# EAGLE design Thermometer (EAGLE 6.4)
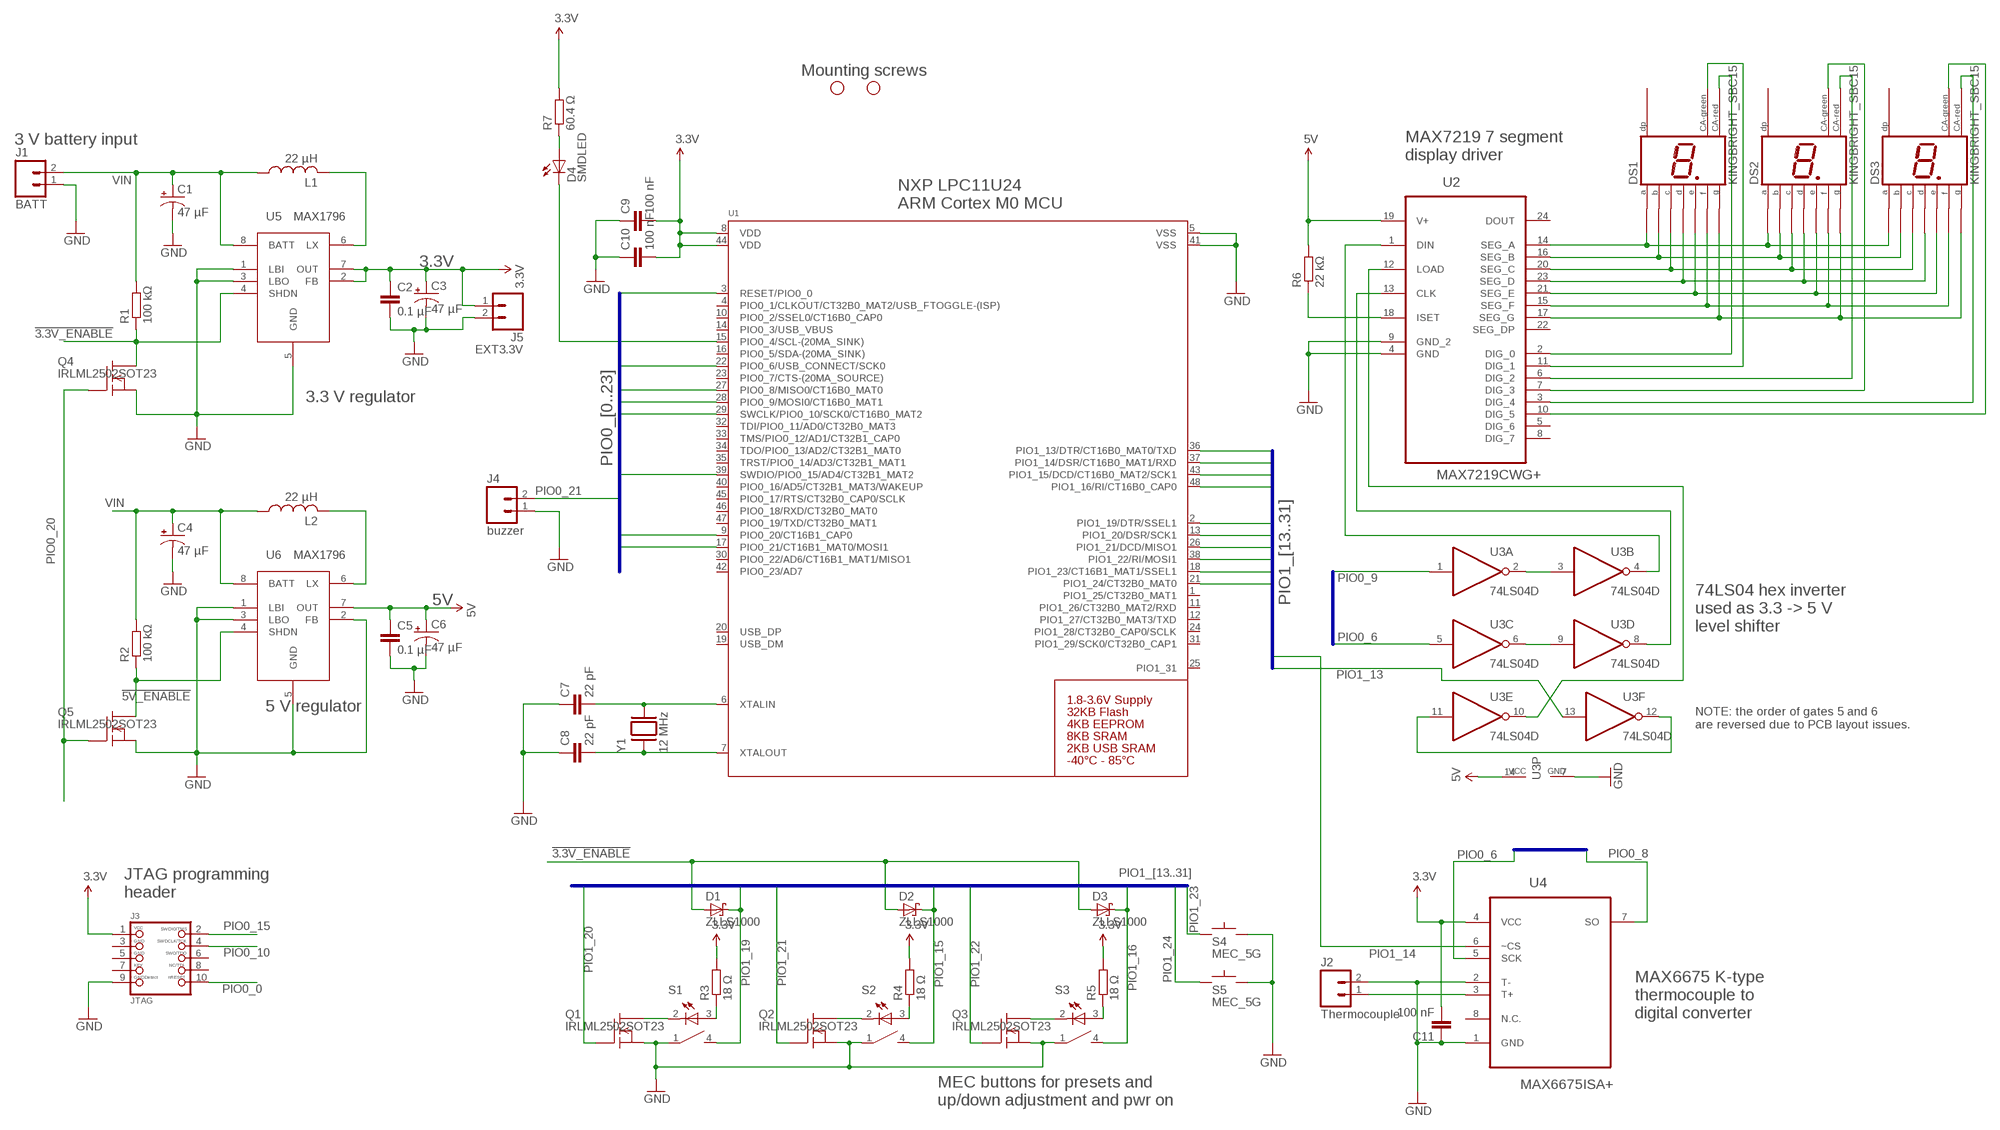
[diagram p0: schematic, sheet 1]

## Parts
C1  47 µF  CPOL-USSMCB  [SMC_B]
C2  0.1 µF  C-EUC0805K  [C0805K]
C3  47 µF  CPOL-USSMCB  [SMC_B]
C4  47 µF  CPOL-USSMCB  [SMC_B]
C5  0.1 µF  C-EUC0805K  [C0805K]
C6  47 µF  CPOL-USSMCB  [SMC_B]
C7  22 pF  C-EUC0805K  [C0805K]
C8  22 pF  C-EUC0805K  [C0805K]
C9  100 nF  C-EUC0805K  [C0805K]
C10  100 nF  C-EUC0805K  [C0805K]
C11  100 nF  C-EUC0805K  [C0805K]
D1  ZLLS1000  BAS40  [SOT23]
D2  ZLLS1000  BAS40  [SOT23]
D3  ZLLS1000  BAS40  [SOT23]
D4  SMDLED  [1206]
DS1  KINGBRIGHT_SBC15  [7-SEG_SBC15]
DS2  KINGBRIGHT_SBC15  [7-SEG_SBC15]
DS3  KINGBRIGHT_SBC15  [7-SEG_SBC15]
J1  BATT  M02PTH  [1X02]
J2  Thermocouple  M02PTH3  [1X02_LONGPADS]
J3  JTAG  JTAG-CORTEXM3  [2X05_1.27MM_SMT]
J4  buzzer  M02PTH  [1X02]
J5  EXT3.3V  M02PTH  [1X02]
L1  22 µH  PANASONIC_ELL5PS  [ELL5PS_INDUCTOR]
L2  22 µH  PANASONIC_ELL5PS  [ELL5PS_INDUCTOR]
MP1  STAND-OFF  [STAND-OFF]
MP2  STAND-OFF  [STAND-OFF]
Q1  IRLML2502SOT23  [SOT23-3]
Q2  IRLML2502SOT23  [SOT23-3]
Q3  IRLML2502SOT23  [SOT23-3]
Q4  IRLML2502SOT23  [SOT23-3]
Q5  IRLML2502SOT23  [SOT23-3]
R1  100 kΩ  R-EU_M0805  [M0805]
R2  100 kΩ  R-EU_M0805  [M0805]
R3  18 Ω  R-EU_M0805  [M0805]
R4  18 Ω  R-EU_M0805  [M0805]
R5  18 Ω  R-EU_M0805  [M0805]
R6  22 kΩ  R-EU_M0805  [M0805]
R7  60.4 Ω  R-EU_M0805  [M0805]
S1  ILLUMEC-4FTH9  [ILLUMEC-4F-TH9]
S2  ILLUMEC-4FTH9  [ILLUMEC-4F-TH9]
S3  ILLUMEC-4FTH9  [ILLUMEC-4F-TH9]
S4  MEC_5G  [ILLUMEC-4F-TH9]
S5  MEC_5G  [ILLUMEC-4F-TH9]
U1  LPC11U24_QFP48  [LQFP48]
U2  MAX7219CWG+  [SOIC127P1032X265-24N]
U3  74LS04D  [SO14]
U4  MAX6675ISA+  [SOIC127P600X175-8N]
U5  MAX1796  [UMAX8]
U6  MAX1796  [UMAX8]
Y1  12 MHz  SMDCRYSTAL  [XTAL_ABM7]

## Nets
3.3V: C2.1 C3.+ C9.2 C10.2 C11.2 J3.1 J5.1 R3.2 R4.2 R5.2 R7.2 U1.8(VDD) U1.44(VDD) U4.4(VCC) U5.2(FB) U5.7(OUT)
5V: C5.1 C6.+ R6.2 U2.19(V+) U3.14(P:VCC) U6.7(OUT)
!3.3V_ENABLE: D1.1(A) D2.1(A) D3.1(A) Q4.3(D) R1.1 U5.4(SHDN)
!5V_ENABLE: Q5.3(D) R2.1 U6.4(SHDN)
GND: C1.- C2.2 C3.- C4.- C5.2 C6.- C7.1 C8.1 C9.1 C10.1 C11.1 J1.1 J2.2 J3.9 J4.1 J5.2 Q1.2(S) Q2.2(S) Q3.2(S) Q4.2(S) Q5.2(S) S1.1 S2.1 S3.1 S4.3 S4.4 S5.3 S5.4 U1.5(VSS) U1.41(VSS) U2.4(GND) U2.9(GND_2) U3.7(P:GND) U4.1(GND) U4.2(T-) U5.1(LBI) U5.3(LBO) U5.5(GND) U6.1(LBI) U6.2(FB) U6.3(LBO) U6.5(GND)
N$1: DS1.P$7(A) DS2.P$7(A) DS3.P$7(A) U2.14(SEG_A)
N$2: DS1.P$6(B) DS2.P$6(B) DS3.P$6(B) U2.16(SEG_B)
N$3: DS1.P$4(C) DS2.P$4(C) DS3.P$4(C) U2.20(SEG_C)
N$4: DS1.P$3(D) DS2.P$3(D) DS3.P$3(D) U2.23(SEG_D)
N$5: DS1.P$2(E) DS2.P$2(E) DS3.P$2(E) U2.21(SEG_E)
N$6: DS1.P$9(F) DS2.P$9(F) DS3.P$9(F) U2.15(SEG_F)
N$7: DS1.P$10(G) DS2.P$10(G) DS3.P$10(G) U2.17(SEG_G)
N$8: DS2.P$5(CA-G) U2.7(DIG_3)
N$9: DS2.P$1(CA-R) U2.6(DIG_2)
N$10: DS3.P$1(CA-R) U2.3(DIG_4)
N$11: DS1.P$5(CA-G) U2.11(DIG_1)
N$12: DS1.P$1(CA-R) U2.2(DIG_0)
N$13: DS3.P$5(CA-G) U2.10(DIG_5)
N$14: R5.1 S3.3(A)
N$15: U3.2(A:O) U3.3(B:I)
N$16: U2.1(DIN) U3.4(B:O)
N$17: U2.13(CLK) U3.8(D:O)
N$18: U2.12(LOAD) U3.10(E:O)
N$19: R6.1 U2.18(ISET)
N$20: Q3.3(D) S3.2(C)
N$21: R4.1 S2.3(A)
N$22: R3.1 S1.3(A)
N$23: Q2.3(D) S2.2(C)
N$24: Q1.3(D) S1.2(C)
N$25: J2.1 U4.3(T+)
N$26: C7.2 U1.6(XTALIN) Y1.P$2
N$27: C8.2 U1.7(XTALOUT) Y1.P$1
N$28: D4.1(A) R7.1
N$29: L2.P$2 U6.6(LX)
N$30: U3.6(C:O) U3.9(D:I)
N$31: L1.P$2 U5.6(LX)
N$32: U3.11(E:I) U3.12(F:O)
PIO0_0: J3.10 U1.3(RESET/PIO0_0)
PIO0_4: D4.2(C) U1.15(PIO0_4/SCL-(20MA_SINK))
PIO0_6: U1.22(PIO0_6/USB_CONNECT/SCK0) U3.5(C:I) U4.5(SCK)
PIO0_8: U1.27(PIO0_8/MISO0/CT16B0_MAT0) U4.7(SO)
PIO0_9: U1.28(PIO0_9/MOSI0/CT16B0_MAT1) U3.1(A:I)
PIO0_10: J3.4 U1.29(SWCLK/PIO0_10/SCK0/CT16B0_MAT2)
PIO0_15: J3.2 U1.39(SWDIO/PIO0_15/AD4/CT32B1_MAT2)
PIO0_20: Q4.1(G) Q5.1(G) U1.9(PIO0_20/CT16B1_CAP0)
PIO0_21: J4.2 U1.17(PIO0_21/CT16B1_MAT0/MOSI1)
PIO1_13: U1.36(PIO1_13/DTR/CT16B0_MAT0/TXD) U3.13(F:I)
PIO1_14: U1.37(PIO1_14/DSR/CT16B0_MAT1/RXD) U4.6(~CS)
PIO1_15: D2.3(C) S2.4 U1.43(PIO1_15/DCD/CT16B0_MAT2/SCK1)
PIO1_16: D3.3(C) S3.4 U1.48(PIO1_16/RI/CT16B0_CAP0)
PIO1_19: D1.3(C) S1.4 U1.2(PIO1_19/DTR/SSEL1)
PIO1_20: Q1.1(G) U1.13(PIO1_20/DSR/SCK1)
PIO1_21: Q2.1(G) U1.26(PIO1_21/DCD/MISO1)
PIO1_22: Q3.1(G) U1.38(PIO1_22/RI/MOSI1)
PIO1_23: S4.1 S4.2 U1.18(PIO1_23/CT16B1_MAT1/SSEL1)
PIO1_24: S5.1 S5.2 U1.21(PIO1_24/CT32B0_MAT0)
VIN: C1.+ C4.+ J1.2 L1.P$1 L2.P$1 R1.2 R2.2 U5.8(BATT) U6.8(BATT)
Unconnected: DS1.P$8(DP) DS2.P$8(DP) DS3.P$8(DP) J3.3 J3.5 J3.6 J3.7 J3.8 U1.1(PIO1_25/CT32B0_MAT1) U1.4(PIO0_1/CLKOUT/CT32B0_MAT2/USB_FTOGGLE-(ISP)) U1.10(PIO0_2/SSEL0/CT16B0_CAP0) U1.11(PIO1_26/CT32B0_MAT2/RXD) U1.12(PIO1_27/CT32B0_MAT3/TXD) U1.14(PIO0_3/USB_VBUS) U1.16(PIO0_5/SDA-(20MA_SINK)) U1.19(USB_DM) U1.20(USB_DP) U1.23(PIO0_7/CTS-(20MA_SOURCE)) U1.24(PIO1_28/CT32B0_CAP0/SCLK) U1.25(PIO1_31) U1.30(PIO0_22/AD6/CT16B1_MAT1/MISO1) U1.31(PIO1_29/SCK0/CT32B0_CAP1) U1.32(TDI/PIO0_11/AD0/CT32B0_MAT3) U1.33(TMS/PIO0_12/AD1/CT32B1_CAP0) U1.34(TDO/PIO0_13/AD2/CT32B1_MAT0) U1.35(TRST/PIO0_14/AD3/CT32B1_MAT1) U1.40(PIO0_16/AD5/CT32B1_MAT3/WAKEUP) U1.42(PIO0_23/AD7) U1.45(PIO0_17/RTS/CT32B0_CAP0/SCLK) U1.46(PIO0_18/RXD/CT32B0_MAT0) U1.47(PIO0_19/TXD/CT32B0_MAT1) U2.5(DIG_6) U2.8(DIG_7) U2.22(SEG_DP) U2.24(DOUT) U4.8(N.C.)

## Buses
PIO1_[13..31]
PIO0_[0..23]

## Notes on the sheet
- Mounting screws
- 3 V battery input
- MAX7219 7 segment
  display driver
- NXP LPC11U24
  ARM Cortex M0 MCU
- 3.3 V regulator
- 74LS04 hex inverter
  used as 3.3 -> 5 V
  level shifter
- 5 V regulator
- NOTE: the order of gates 5 and 6 
  are reversed due to PCB layout issues.
- JTAG programming
  header
- MAX6675 K-type
  thermocouple to
  digital converter
- MEC buttons for presets and
  up/down adjustment and pwr on

## Library data of the parts
C1 C3 C4 C6 = rcl:CPOL-US: POLARIZED CAPACITOR, American symbol; POS: Project box; RS: 699-3431
C2 C5 C7-C11 = rcl:C-EU: CAPACITOR, European symbol; POS: SMD box; RS: ?
D1-D3 = diode:BAS40: Silicon Schottky Diodes General-purpose diode for high-speed switching; POS: ESD; RS: 155-169
D4 = jenswilly_custom:SMDLED: SMD LED; POS: ESD; RS: ?
DS1-DS3 = jenswilly_custom:KINGBRIGHT_SBC15: Kingbright SBC15-11/SBA15-11 1.5" dual color 7 segment display.; POS: Project box; RS: 235-9130
J1 J2 J4 = SparkFun-Connectors:M02: Header 2 Standard 2-pin 0.1" header. Use with straight break away headers (SKU : PRT-00116), right angle break away headers (PRT-00553), swiss pins (PRT-00743), machine pins (PRT-00117), and female headers (PRT-00115). Molex polarized connector foot print use with SKU : PRT-08233 with associated crimp pins and housings.; POS: n/a
J3 = microbuilder:JTAG-CORTEXM3: Serial Wire (SW-DP) Connector This standard 0.05" 10-pin connector is for use with the Cortex M0/M3's native SWD (serial wire debugger) interface (SW-DP). Some boards support a 20-pin combined JTAG+SWD connector (SWJ-DP), such as the LPC1700 family, but many smaller devices only work with SWD which typically use the smaller 10-pin SW-DP connecter (the LPC1300 family, for example, only supports SWD). 2x05 1.27mm/0.05" Connector: This is the standard SMT connector defined by ARM for all Cortex devices, and should be used in most situations and for forward-compatibility since any new devices coming to market will likely use this connector. MOLEX 10 Pin 0.1" Connector: This 0.1" 10 pin connector has the same pin layout as the standard 0.05" connector, but is easier to work with if you are using standard jumper wires or custom cables to connect your SWD hardware. MOLEX 20 Pin 0.1" Connector: This 0.1" 20 pin connector is the same model used for ARM7/ARM9 JTAG debuggers, but is connected to match the pins on the Segger J-Link for ARM (which supports both JTAG and SWD debugging). See the following document from ARM for more information on Cortex M3 Debug Connectors: http://infocenter.arm.com/help/topic/com.arm.doc.faqs/attached/13634/cortex_debug_connectors.pdf And the following page for an overview with images of the different connector types: http://www.keil.com/peripherals/coresight/connectors.asp; POS: Misc. box; RS: 681-1200
J5 = SparkFun-Connectors:M02: Header 2 Standard 2-pin 0.1" header. Use with straight break away headers (SKU : PRT-00116), right angle break away headers (PRT-00553), swiss pins (PRT-00743), machine pins (PRT-00117), and female headers (PRT-00115). Molex polarized connector foot print use with SKU : PRT-08233 with associated crimp pins and housings.
L1 L2 = jenswilly_custom:PANASONIC_ELL5PS: Panasonic ELL5PS SMD inductor; POS: SMD box; RS: ?
MP1 MP2 = SparkFun-Electromechanical:STAND-OFF: #4 Stand Off This is the mechanical footprint for a #4 phillips button head screw. Use the keepout ring to avoid running the screw head into surrounding components. SKU : PRT-00447
Q1-Q5 = jenswilly_custom:IRLML2502: IRLML2502PbF HEXFET Power MOSFET N-channel MOSFET Vdss 20V Rds(on) 0.045? Vgs(th), max 1.2V Datasheet: http://www.irf.com/product-info/datasheets/data/irlml2502.pdf; POS: ESD; RS: 610-6693
R1 R2 R6 = rcl:R-EU_: RESISTOR, European symbol; BOM: EXCLUDE; POS: ?; RS: ?
R3-R5 = rcl:R-EU_: RESISTOR, European symbol; POS: Project box; RS: 679-0964
R7 = rcl:R-EU_: RESISTOR, European symbol; POS: SMD box; RS: ?
S1-S3 = jenswilly_custom:ILLUMEC-4F: Illumec 4F; FARNELL: 2280492; POS: Project box; RS: ?
S4 S5 = jenswilly_custom:MEC_5G: MEC 5G MEC 5GTH9 normally-open momentary SPST switch, non-illuminated.; FARNELL: 2280480; POS: Project box; RS: ?
U1 = microbuilder:LPC11U24_QFP48: LPC11U24 - ARM Cortex M0 50MHz MCU Supply: 1.8-3.6V Flash: 32KB EEPROM: 4KB SRAM: 8KB + 2KB USB Temp: -40°C - 85°C; POS: ESD; RS: ?
U2 = Maxim_By_element14_Batch_1:MAX7219CWG+: Serially Interfaced, 8-Digit LED Display Drivers; BOM: EXCLUDE; MPN: MAX7219CWG+; OC_FARNELL: 9726357; OC_NEWARK: 67K6644; PACKAGE: SOIC-24; POS: ?; RS: ?; SUPPLIER: Maxim
U3 = 74xx-eu:74*04: Hex INVERTER; BOM: EXCLUDE; POS: ?; RS: ?
U4 = Maxim_By_element14_Batch_1:MAX6675ISA+: Cold-Junction-Compensated K-Thermocoupleto-to-; BOM: EXCLUDE; MPN: MAX6675ISA+; OC_FARNELL: 1379740; OC_NEWARK: 68K4982; PACKAGE: SOIC-8; POS: Project box; RS: 698-7118; SUPPLIER: Maxim
U5 U6 = jenswilly_custom:MAX1796: Maxim MAX1796 Also MAX1795, MAX1797 Low Supply Current, Step-Up DC-DC Converters with True-Shutdown Datasheet <http://datasheets.maximintegrated.com/en/ds/MAX1795-MAX1797.pdf>; POS: Project box; RS: 732-7721
Y1 = jenswilly_custom:SMDCRYSTAL: SMD Crystal; POS: SMD box; RS: ?

## Board
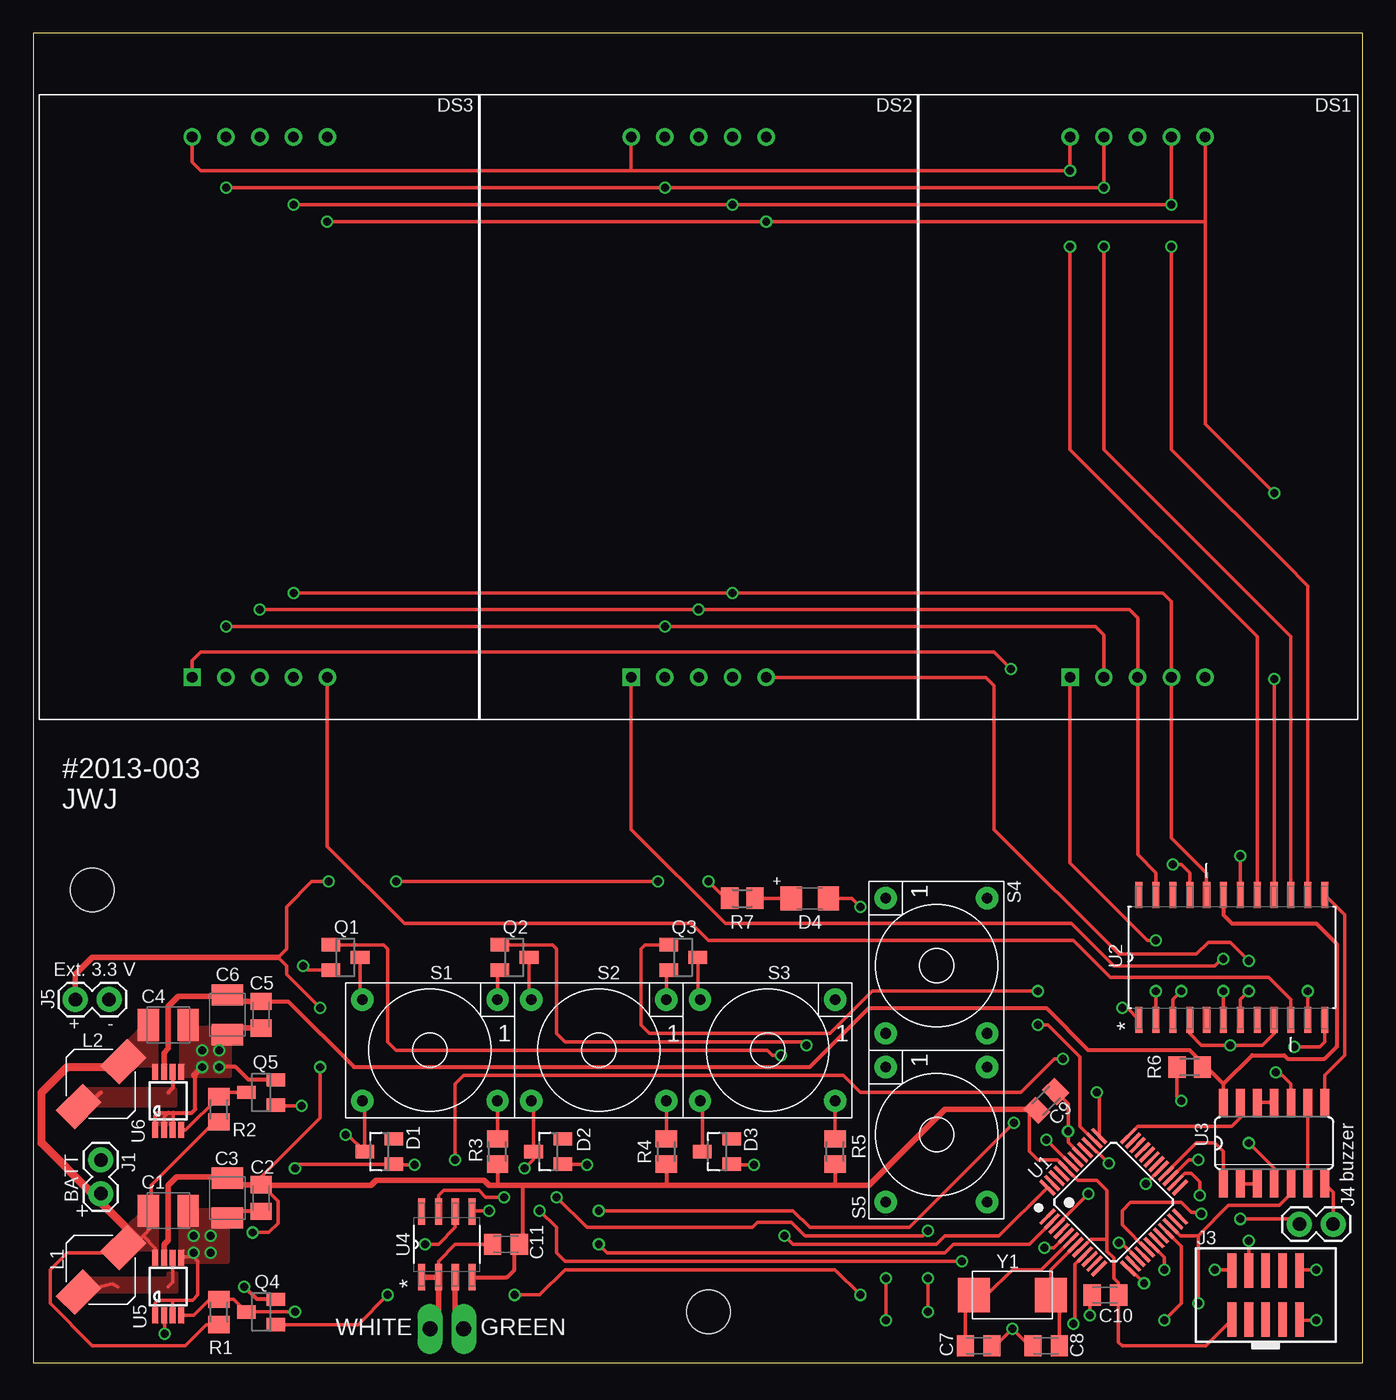
[diagram p1: board, top side]
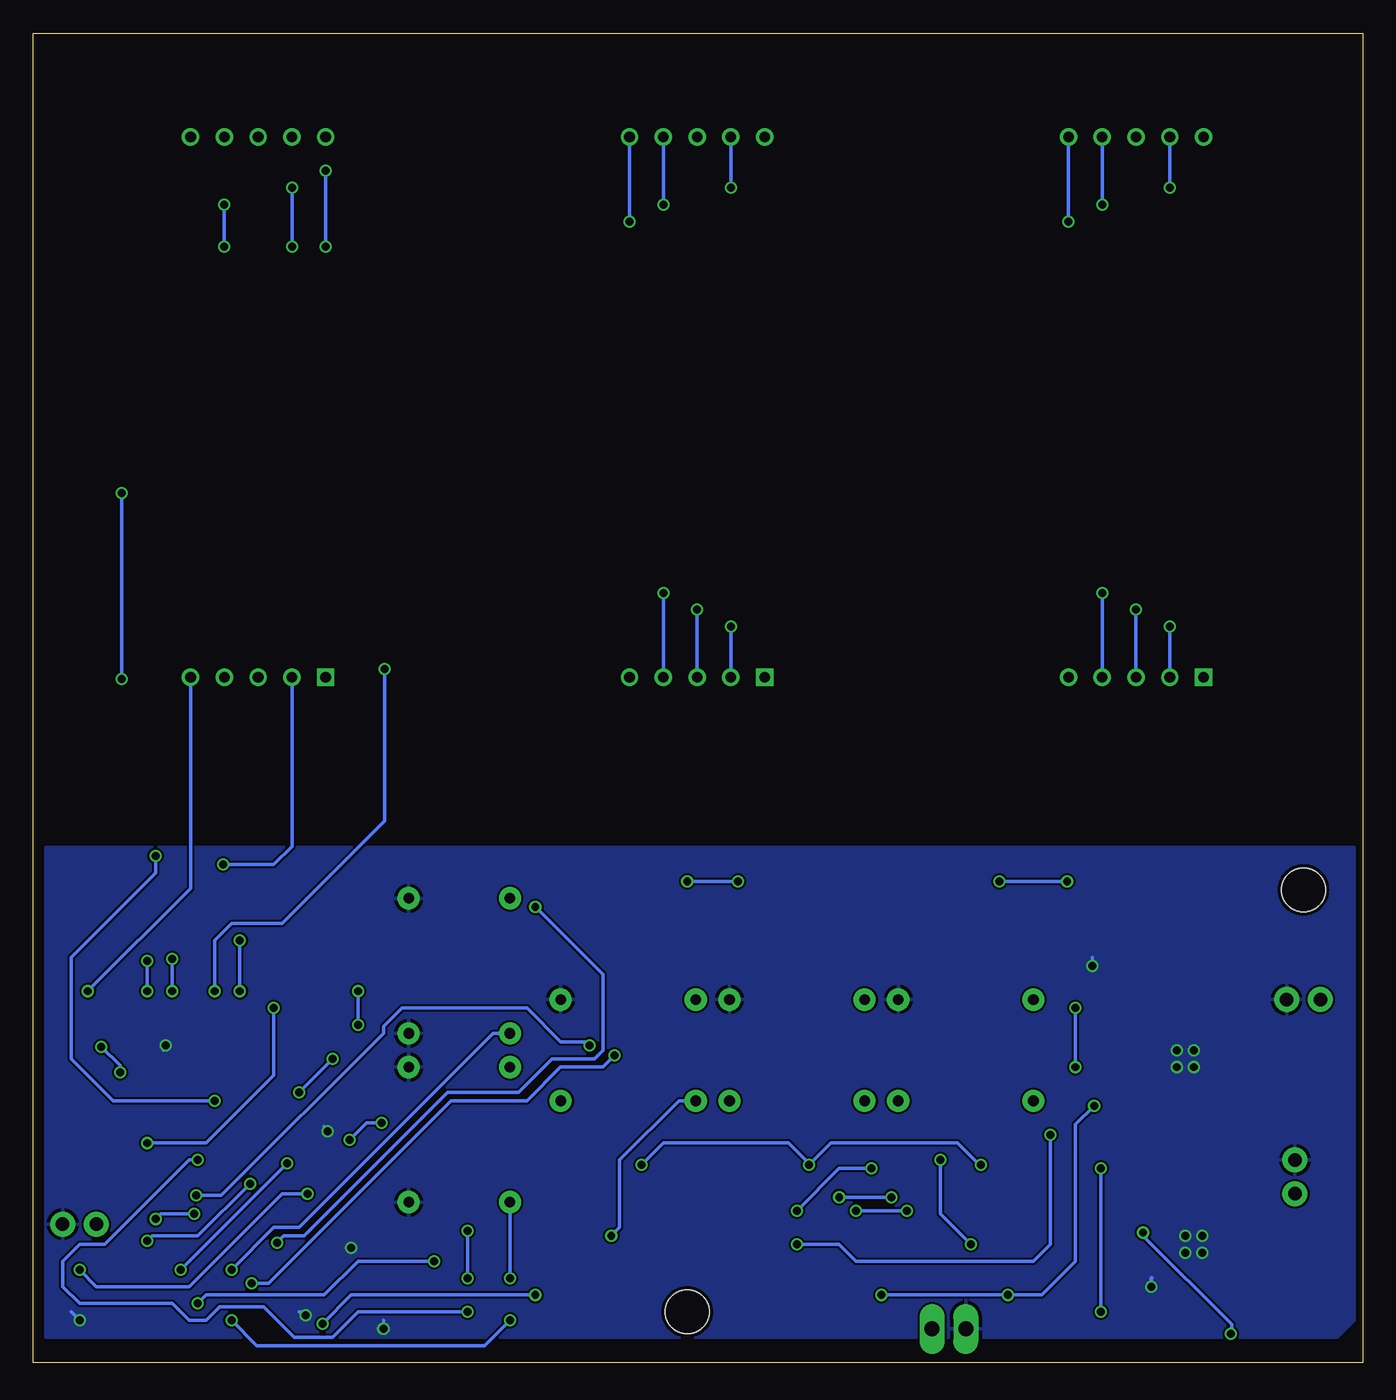
[diagram p2: board, bottom side, seen from below]

Size 100 x 100 mm. Coordinates in mm from the lower left corner, seen from the top.
Outline: 0,0 100,0 100,100 0,100 0,0
Copper layers (1*16): Top 0.035mm / dielectric 1.5mm / Bottom 0.035mm
Design rules "ITEADstudio_DRC": minimum track width 6mil, minimum drill 12mil, track to track 6mil, track to pad 6mil, pad to pad 6mil, via to via 6mil, smd to smd 0mil, copper to edge 10mil, drill to drill 10mil, minimum pad ring 10mil, minimum via ring 6mil, stop-mask expansion 2mil, vias tented up to drill 100mil, thermal gap 10mil

### Footprints (pad centres in the part's own frame; a part is rotated, then mirrored left to right if it is on the bottom)
SMC_B = smd 1.6 x 2.4: + -1.5,0; - 1.5,0
C0805K = smd 1.3 x 1.6: 1 -1,0; 2 1,0
SOT23 = smd 1 x 1.4: 1 -0.95,-1.1; 2 0.95,-1.1; 3 0,1.1
1206 = smd 1.6 x 1.8: 1 -1.4,0; 2 1.4,0
7-SEG_SBC15 = drill 0.8 square: P$1 -5.08,-20.32 | drill 0.8: P$2 -2.54,-20.32; P$3 0,-20.32; P$4 2.54,-20.32; P$5 5.08,-20.32; P$6 5.08,20.32; P$7 2.54,20.32; P$8 0,20.32; P$9 -2.54,20.32; P$10 -5.08,20.32
1X02 = drill 1.016 pad 1.88: 1 0,0; 2 2.54,0
1X02_LONGPADS = drill 1.118 pad 1.88 long: 1 0,0; 2 2.54,0
2X05_1.27MM_SMT = smd 0.65 x 2.6: 1 -2.54,-1.85; 2 -2.54,1.85; 3 -1.27,-1.85; 4 -1.27,1.85; 5 0,-1.85; 6 0,1.85; 7 1.27,-1.85; 8 1.27,1.85; 9 2.54,-1.85; 10 2.54,1.85
ELL5PS_INDUCTOR = smd 2.85 x 2 rotated 225: P$1 1.686,1.672; P$2 -1.672,-1.686
STAND-OFF = hole 3.302: 0,0
SOT23-3 = smd 1 x 1.4: 1 -0.95,-1.1; 2 0.95,-1.1; 3 0,1.1
M0805 = smd 1.3 x 1.6: 1 -0.95,0; 2 0.95,0
ILLUMEC-4F-TH9 = drill 0.8 pad 1.676: 1 5.08,3.81; 2 -5.08,3.81; 3 5.08,-3.81; 4 -5.08,-3.81
LQFP48 = smd 1.5 x 0.25: 1 -4.3,2.75; 2 -4.3,2.25; 3 -4.3,1.75; 4 -4.3,1.25; 5 -4.3,0.75; 6 -4.3,0.25; 7 -4.3,-0.25; 8 -4.3,-0.75; 9 -4.3,-1.25; 10 -4.3,-1.75; 11 -4.3,-2.25; 12 -4.3,-2.75; 25 4.3,-2.75; 26 4.3,-2.25; 27 4.3,-1.75; 28 4.3,-1.25; 29 4.3,-0.75; 30 4.3,-0.25; 31 4.3,0.25; 32 4.3,0.75; 33 4.3,1.25; 34 4.3,1.75; 35 4.3,2.25; 36 4.3,2.75 | smd 0.25 x 1.5: 13 -2.75,-4.3; 14 -2.25,-4.3; 15 -1.75,-4.3; 16 -1.25,-4.3; 17 -0.75,-4.3; 18 -0.25,-4.3; 19 0.25,-4.3; 20 0.75,-4.3; 21 1.25,-4.3; 22 1.75,-4.3; 23 2.25,-4.3; 24 2.75,-4.3; 37 2.75,4.3; 38 2.25,4.3; 39 1.75,4.3; 40 1.25,4.3; 41 0.75,4.3; 42 0.25,4.3; 43 -0.25,4.3; 44 -0.75,4.3; 45 -1.25,4.3; 46 -1.75,4.3; 47 -2.25,4.3; 48 -2.75,4.3
SOIC127P1032X265-24N = smd 1.981 x 0.533: 1 -4.699,6.985; 2 -4.699,5.715; 3 -4.699,4.445; 4 -4.699,3.175; 5 -4.699,1.905; 6 -4.699,0.635; 7 -4.699,-0.635; 8 -4.699,-1.905; 9 -4.699,-3.175; 10 -4.699,-4.445; 11 -4.699,-5.715; 12 -4.699,-6.985; 13 4.699,-6.985; 14 4.699,-5.715; 15 4.699,-4.445; 16 4.699,-3.175; 17 4.699,-1.905; 18 4.699,-0.635; 19 4.699,0.635; 20 4.699,1.905; 21 4.699,3.175; 22 4.699,4.445; 23 4.699,5.715; 24 4.699,6.985
SO14 = smd 0.66 x 2.032: 1 -3.81,-3.073; 2 -2.54,-3.073; 3 -1.27,-3.073; 4 0,-3.073; 5 1.27,-3.073; 6 2.54,-3.073; 7 3.81,-3.073; 8 3.81,3.073; 9 2.54,3.073; 10 1.27,3.073; 11 0,3.073; 12 -1.27,3.073; 13 -2.54,3.073; 14 -3.81,3.073
SOIC127P600X175-8N = smd 1.981 x 0.533: 1 -2.464,1.905; 2 -2.464,0.635; 3 -2.464,-0.635; 4 -2.464,-1.905; 5 2.464,-1.905; 6 2.464,-0.635; 7 2.464,0.635; 8 2.464,1.905
UMAX8 = smd 0.45 x 1.2: 1 -0.975,-2.175; 2 -0.325,-2.175; 3 0.325,-2.175; 4 0.975,-2.175; 5 0.975,2.175; 6 0.325,2.175; 7 -0.325,2.175; 8 -0.975,2.175
XTAL_ABM7 = smd 2.4 x 2.6: P$1 -2.9,0; P$2 2.9,0

### Placement (x,y rotation side)
C1  10.16,11.43 0 top
C2  17.14,12.38 270 top
C3  14.61,12.38 270 top
C4  10.16,25.4 0 top
C5  17.14,26.16 270 top
C6  14.61,26.16 270 top
C7  71.12,1.27 180 top
C8  76.2,1.27 0 top
C9  76.2,19.68 225 top
C10  80.64,5.08 0 top
C11  35.56,8.89 0 top
D1  26.04,15.88 90 top
D2  38.73,15.88 90 top
D3  51.44,15.88 90 top
D4  58.42,34.92 0 top
DS1  83.08,71.87 0 top
DS2  50.06,71.87 0 top
DS3  17.04,71.87 0 top
J1  5.08,15.24 270 top
J2  32.38,2.54 180 top
J3  92.71,5.08 0 top
J4  97.79,10.41 180 top
J5  3.17,27.3 0 top
L1  5.08,6.99 0 top
L2  5.08,20.95 0 top
MP1  50.8,3.81 0 top
MP2  4.45,35.56 0 top
Q1  23.5,30.48 270 top
Q2  36.2,30.48 270 top
Q3  48.9,30.48 270 top
Q4  17.14,3.81 90 top
Q5  17.14,20.32 90 top
R1  13.97,3.81 270 top
R2  13.97,19.05 270 top
R3  34.92,15.88 270 top
R4  47.62,15.88 270 top
R5  60.33,15.88 270 top
R6  87,22.23 0 top
R7  53.34,34.92 180 top
S1  29.84,23.5 0 top
S2  42.55,23.5 0 top
S3  55.24,23.5 0 top
S4  67.94,29.84 90 top
S5  67.94,17.14 90 top
U1  81.28,12.06 45 top
U2  90.17,30.48 90 top
U3  93.34,16.51 0 top
U4  31.11,8.89 90 top
U5  10.16,5.71 0 top
U6  10.16,19.68 0 top
Y1  73.66,5.08 180 top

### Tracks (layer width: path | path; a pad name or v marks a point on that pad's centre or on a via)
3.3V  (via drill 0.6)
  Top 0.254: U5.2 9.84,2.87 9.91,2.87 v9.91,2.16 | v16.51,9.78 17.72,9.78 18.41,10.47 18.41,12.11 17.19,13.34 | U1.8 79.55,9.27 80.77,9.27 | 80.77,9.27 80.77,12.95 80.01,13.72 78.57,13.72 U1.44 77.04,15.24 75.56,15.24 74.93,15.88 74.93,19.05 | J3.1 88.21,1.27 81.92,1.27 81.64,1.54 C10.2 81.64,5.99 81.28,6.35 81.28,7.87 80.77,8.38 80.77,9.27 | R7.2 52.07,34.92 v50.8,36.2 | v46.99,36.2 v27.3,36.2 | v22.23,36.2 20.95,36.2 19.05,34.29 19.05,31.11 18.41,30.48 19.05,29.84 19.05,29.21 v21.59,26.67 | v21.59,22.23 21.59,18.41 17.14,13.97 C2.1
  Top 0.305: 15.11,13.38 C3.+ | U4.4 35.64,6.43 36.2,6.99 36.2,8.53 C11.2 36.83,8.89 36.83,13.34 | R3.2 34.92,13.34 | R4.2 47.62,13.34 | R5.2 60.33,13.34
  Top 0.406: U5.7 9.84,8.88 10.16,9.21 10.16,13.34 10.79,13.97 14.52,13.97 C3.+ | 15.11,13.38 C2.1 17.19,13.34 25.4,13.34 25.78,13.72 33.91,13.72 34.29,13.34 34.92,13.34 36.83,13.34 47.62,13.34 60.33,13.34 62.87,13.34 68.58,19.05 74.93,19.05 75,18.98 C9.2 | J5.1 3.17,29.21 4.45,30.48 18.41,30.48
  Bottom 0.254: v9.91,2.16 9.84,2.16 9.84,2.87 9.85,2.87 16.51,9.53 v16.51,9.78 | v50.8,36.2 v46.99,36.2 | v27.3,36.2 v22.23,36.2 | v21.59,26.67 v21.59,22.23
5V
  Top 0.254: 89.53,20.95 U3.14 | 88.27,22.23 R6.2
  Top 0.305: U2.19 89.53,33.66 90.17,33.02 96.52,33.02 98.04,31.5 98.04,23.75 97.16,22.86 94.36,22.86 94.11,23.11 91.69,23.11 89.53,20.95 88.27,22.23 | C5.1 19.19,27.16 24.13,22.23 58.42,22.23 62.87,26.67 76.2,26.67 79.38,23.5 87,23.5 87.94,22.55 R6.2
  Top 0.406: U6.7 9.84,23.3 10.16,23.62 10.16,26.8 10.92,27.56 14.5,27.56 C6.+ 15.11,27.16 C5.1
!3.3V_ENABLE  (via drill 0.6)
  Top 0.254: D3.1 52.6,14.86 v54.23,14.86 | v41.66,14.86 41.59,14.93 D2.1 | v28.7,14.86 27.2,14.86 D1.1 20,14.93 v19.68,14.61 | Q4.3 v19.68,3.81 | 15.75,4.11 Q4.3 | U5.4 11.15,3.56 12.06,3.56 13.27,4.76 R1.1 15.1,4.76 Q4.3
  Bottom 0.254: v19.68,3.81 v19.68,14.61 | v28.7,14.86 28.83,14.86 30.48,16.51 40.01,16.51 v41.66,14.86 41.66,14.99 43.18,16.51 52.58,16.51 v54.23,14.86
!5V_ENABLE
  Top 0.254: U6.4 11.48,17.51 R2.1 14.29,20.32 Q5.3
GND  (via drill 0.6)
  Top 0.254: U5.5 11.18,7.94 12.06,7.94 12.38,7.62 12.38,5.08 12,4.7 10.48,4.7 | 10.48,4.7 9.4,4.7 9.19,4.49 U5.1 | U5.3 10.48,4.7 | U6.3 10.54,17.51 10.54,18.8 | U6.2 9.84,18.47 10.16,18.8 | C10.1 79.38,4.81 79.5,4.68 v79.5,3.56 | U1.41 77.85,16.55 v77.85,17.4 77.85,19.45 C9.1 | J3.9 95.31,3.17 v96.52,3.17 | Q2.2 34.92,29.36 S1.1 | Q3.2 47.62,29.36 S2.1 | U2.4 87,24.77 87.88,23.88 v90.04,23.88 92.46,23.88 93.34,24.77 U2.9 | Q1.2 20.64,29.53 v20.32,29.84 | v76.07,8.64 76.79,8.64 U1.5 | C7.1 72.39,1.27 v73.66,2.54 74.93,1.27 C8.1 | U4.2 30.48,7.62 31.75,8.89 C11.1 | J4.1 97.79,12.8 U3.7
  Top 0.305: C2.2 15.11,11.38 C3.- | Q4.2 16.83,4.76 v15.88,5.71 | U6.1 9.19,18.58 9.4,18.8 10.16,18.8 10.54,18.8 11.94,18.8 12.19,19.05 12.19,21.46 12.06,21.59 | Q5.2 16.2,21.27 15.24,22.23 v13.97,22.23
  Top 0.406: 12.06,21.59 v12.7,22.23 | C5.2 15.11,25.16 C6.- | U4.1 U4.2 30.48,2.54 J2.2
  Bottom 0.254: v79.5,3.56 79.76,3.81 80.01,3.81 | v77.85,17.4 77.85,17.53 78.11,17.78 | v96.52,3.17 97.16,3.81 | v90.04,23.88 90.04,23.62 90.17,23.5 | v20.32,29.84 20.32,30.48 | v76.07,8.64 76.07,8.76 76.2,8.89 | v73.66,2.54 73.66,3.17
  Bottom 0.305: v15.88,5.71 15.88,6.35
  other vias: 12.06,8.26 12.06,9.53 13.34,8.26 13.34,9.53 12.7,23.5 13.97,23.5
  pour Top (no thermals): 11.43,7.62 14.61,7.62 14.61,11.43 11.43,11.43 11.11,11.11 11.11,7.94
  pour Bottom: 1.91,1.91 99.06,1.91 99.06,38.73 0.64,38.73 0.64,3.17
  pour Top (no thermals): 12.06,21.59 11.18,21.59 11.18,24.77 11.56,25.15 14.1,25.15 14.73,24.51 14.73,21.59
  pour Top (no thermals): 9.4,17.91 10.41,17.91 10.41,18.67 9.4,18.67
N$1  (via drill 0.6)
  Top 0.254: v19.58,87.11 v52.6,87.11 v85.62,87.11 DS1.P$7 | v85.62,83.94 85.62,68.69 94.94,59.38 95.14,59.17 95.89,58.43 U2.14
  Bottom 0.254: DS3.P$7 v19.58,87.11 | DS2.P$7 v52.6,87.11 | v85.62,87.11 v85.62,83.94
N$2  (via drill 0.6)
  Top 0.254: v22.12,85.84 v55.14,85.84 88.16,85.84 | DS1.P$6 88.16,85.84 | 88.16,85.84 88.16,70.6 v93.34,65.42 v93.34,65.41 | U2.16 v93.34,51.44
  Bottom 0.254: DS3.P$6 v22.12,85.84 | DS2.P$6 v55.14,85.84 | v93.34,51.44 v93.34,65.41
N$3  (via drill 0.6)
  Top 0.254: v19.58,57.9 v52.6,57.9 84.98,57.9 85.62,57.27 DS1.P$4 85.62,39.48 88.27,36.83 U2.20
  Bottom 0.254: DS3.P$4 v19.58,57.9 | DS2.P$4 v52.6,57.9
N$4  (via drill 0.6)
  Top 0.254: v17.04,56.63 v50.06,56.63 82.44,56.63 83.08,55.99 DS1.P$3 83.08,38.2 84.45,36.83 U2.23
  Bottom 0.254: DS3.P$3 v17.04,56.63 | DS2.P$3 v50.06,56.63
N$5  (via drill 0.6)
  Top 0.254: DS1.P$2 80.54,54.73 79.91,55.36 v47.52,55.36 v14.5,55.36 | U2.21 87,36.83 86.36,37.47 v85.72,37.47
  Bottom 0.254: DS3.P$2 v14.5,55.36 | DS2.P$2 v47.52,55.36 | v85.72,37.47 81.92,37.47 80.54,38.84 DS1.P$2
N$6  (via drill 0.6)
  Top 0.254: v14.5,88.38 v47.52,88.38 v80.54,88.38 DS1.P$9 | v80.54,83.94 80.54,68.69 94.61,54.62 U2.15
  Bottom 0.254: DS3.P$9 v14.5,88.38 | DS2.P$9 v47.52,88.38 | v80.54,88.38 v80.54,83.94
N$7  (via drill 0.6)
  Top 0.254: 44.98,89.65 v78,89.65 DS1.P$10 | 44.98,89.65 12.6,89.65 11.96,90.28 DS3.P$10 | DS2.P$10 44.98,89.65 | v78,83.94 78,68.69 91.13,55.57 91.33,55.36 92.08,54.62 U2.17
  Bottom 0.254: v78,89.65 v78,83.94
N$8  (via drill 0.6)
  Top 0.254: DS2.P$5 71.65,51.55 72.28,50.91 72.28,40.11 81.66,30.73 87.5,30.73 88.39,31.62 90.04,31.62 v91.44,30.23 | U2.7 90.81,27.3 v91.44,27.94
  Bottom 0.254: v91.44,27.94 v91.44,30.23
N$9  (via drill 0.6)
  Top 0.254: v89.53,30.35 89.41,30.35 88.9,29.84 81.28,29.84 78.11,33.02 52.07,33.02 44.98,40.11 DS2.P$1 | v89.53,27.94 U2.6
  Bottom 0.254: v89.53,30.35 v89.53,27.94
N$10  (via drill 0.6)
  Top 0.254: DS3.P$1 11.96,52.82 12.6,53.45 72.28,53.45 v73.56,52.19 | U2.3 85.72,27.3 v86.36,27.94
  Bottom 0.254: v86.36,27.94 86.36,31.75 85.09,33.02 81.28,33.02 73.56,40.74 v73.56,52.19
N$11  (via drill 0.6)
  Top 0.254: U2.11 v95.89,27.94
  Bottom 0.254: v95.89,27.94 88.16,35.66 DS1.P$5
N$12  (via drill 0.6)
  Top 0.254: U2.2 v84.45,27.94 | v84.45,31.75 83.82,31.75 78,37.57 DS1.P$1
  Bottom 0.254: v84.45,31.75 v84.45,27.94
N$13
  Top 0.254: U2.10 94.61,27.3 92.96,28.96 81.03,28.96 78.23,31.75 50.8,31.75 49.53,33.02 27.94,33.02 22.12,38.84 DS3.P$5
N$14
  Top 0.254: S3.3 R5.1
N$15
  Top 0.254: U3.3 U3.2
N$16  (via drill 0.6)
  Top 0.254: U3.4 93.34,14.61 v91.44,16.51 | v81.92,26.67 82.3,26.67 U2.1
  Bottom 0.254: v91.44,16.51 87,16.51 81.92,21.59 v81.92,26.67
N$17
  Top 0.254: U3.8 97.16,21.59 98.68,23.11 98.68,33.66 U2.13
N$18  (via drill 0.6)
  Top 0.254: v94.87,23.75 96.77,23.75 97.16,24.13 U2.12 | v93.47,21.84 93.73,21.59 93.98,21.59 94.61,20.95 U3.10
  Bottom 0.254: v93.47,21.84 93.47,22.35 v94.87,23.75
N$19  (via drill 0.6)
  Top 0.254: U2.18 v90.81,38.1 | R6.1 86.05,20 v86.36,19.68
  Bottom 0.254: v90.81,38.1 90.81,36.83 97.16,30.48 97.16,22.86 93.98,19.68 v86.36,19.68
N$20
  Top 0.254: S3.2 49.99,27.48 Q3.3
N$21
  Top 0.254: S2.3 R4.1
N$22
  Top 0.254: S1.3 R3.1
N$23
  Top 0.254: S2.2 37.3,27.48 Q2.3
N$24
  Top 0.254: S1.2 24.59,27.48 Q1.3
N$25
  Top 0.406: J2.1 31.75,3.17 U4.3
N$26
  Top 0.254: C7.2 70.12,4.44 Y1.P$2 71.75,5.08 73.66,6.99 75.85,6.99 U1.6
N$27
  Top 0.254: Y1.P$1 77.2,4.44 C8.2 | 76.33,5.08 Y1.P$1 | U1.7 76.56,6.99 Y1.P$1
N$28
  Top 0.254: D4.1 R7.1
N$29
  Top 0.305: U6.6 10.48,20.63 10.47,20.63 10.16,20.32 | L2.P$2 4.03,19.27 5.08,20.32
  pour Top (no thermals): 10.67,19.3 4.06,19.3 4.06,20.57 10.67,20.57
N$30
  Top 0.254: U3.9 U3.6
N$31
  Top 0.254: U5.6 10.48,6.04 10.16,5.71 | L1.P$2 5.93,5.93 6.35,5.71
  pour Top (no thermals): 10.79,6.73 10.16,6.73 10.16,6.35 3.81,6.35 3.81,5.33 10.79,5.33
N$32
  Top 0.254: U3.12 U3.11
PIO0_0  (via drill 0.6)
  Top 0.254: J3.10 95.31,6.99 v96.52,6.99 | v79.38,12.7 77,10.33 U1.3
  Bottom 0.254: v96.52,6.99 95.25,5.71 88.27,5.71 81.28,12.7 v79.38,12.7
PIO0_4  (via drill 0.6)
  Top 0.254: U1.15 81.85,9.02 v81.66,9.02 | v62.23,34.29 61.59,34.92 D4.2
  Bottom 0.254: v81.66,9.02 81.15,9.53 79.63,9.53 68.83,20.32 63.5,20.32 60.96,22.86 57.78,22.86 57.15,23.5 57.15,29.21 v62.23,34.29
PIO0_6  (via drill 0.6)
  Top 0.254: v69.85,7.62 40.01,7.62 39.37,8.26 39.37,10.16 v38.1,11.43 | v34.29,11.43 33.1,11.43 U4.5 | v87.63,4.45 87.63,9.53 | 87.63,9.53 86.3,9.53 U1.22 | 87.63,9.53 89.92,11.81 93.73,11.81 94.61,12.7 U3.5
  Bottom 0.254: v69.85,7.62 75.56,7.62 78.11,5.08 87,5.08 v87.63,4.45 | v38.1,11.43 v34.29,11.43
PIO0_8  (via drill 0.6)
  Top 0.254: 85.62,13.87 U1.27 86.93,15.24 v87.63,15.24 | U4.7 30.48,12.57 30.86,12.95 33.53,12.95 34.04,12.45 v35.43,12.45 | v39.37,12.45 41.66,10.16 54.1,10.16 54.48,10.54 57.02,10.54 58.04,9.53 66.93,9.53 v67.31,9.91 | v67.31,3.81 v67.31,6.35
  Bottom 0.254: v87.63,15.24 88.27,15.24 94.61,8.89 96.52,8.89 97.79,7.62 97.79,5.71 96.52,4.45 89.53,4.45 88.27,3.17 87,3.17 85.98,4.19 82.68,4.19 80.39,1.91 77.47,1.91 75.56,3.81 v67.31,3.81 | v35.43,12.45 v39.37,12.45 | v67.31,6.35 v67.31,9.91
PIO0_9
  Top 0.254: U3.1 89.53,15.88 88.9,16.51 87.49,16.51 U1.28
PIO0_10  (via drill 0.6)
  Top 0.254: J3.4 v91.44,9.14 | v83.69,13.46 84.81,14.57 U1.29
  Bottom 0.254: v91.44,9.14 91.06,9.53 87.63,9.53 v83.69,13.46
PIO0_15  (via drill 0.6)
  Top 0.254: J3.2 90.11,6.99 v88.9,6.99 | v80.9,14.99 79.54,16.34 U1.39
  Bottom 0.254: v88.9,6.99 v80.9,14.99
PIO0_20  (via drill 0.6)
  Top 0.254: U1.9 78.36,7.38 78.36,3.05 v78.23,2.92 | Q4.1 24.45,2.86 v26.67,5.08 | v20.19,19.3 18.31,19.3 Q5.1 | v36.2,5.08 38.1,5.08 40.01,6.99 60.33,6.99 v62.23,5.08
  Bottom 0.254: v78.23,2.92 76.07,5.08 v62.23,5.08 | v36.2,5.08 v26.67,5.08 24.13,5.08 21.59,7.62 21.59,17.91 v20.19,19.3
PIO0_21  (via drill 0.6)
  Top 0.254: U1.17 81.92,10.37 81.92,11.43 82.55,12.06 86.36,12.06 87.12,11.3 87.76,11.3 v87.88,11.18 | v90.81,10.79 94.87,10.79 J4.2
  Bottom 0.254: v87.88,11.18 90.42,11.18 v90.81,10.79
PIO1_13
  Top 0.254: U1.36 83.11,17.78 90.17,17.78 90.81,18.41 U3.13
PIO1_14  (via drill 0.6)
  Top 0.254: U1.37 80.18,20.15 v80.01,20.32 | v77.47,22.86 76.83,22.86 74.3,20.32 62.23,20.32 60.96,21.59 32.38,21.59 31.75,20.95 v31.75,15.24 | U4.6 31.75,10.16 30.48,8.89 v29.46,8.89
  Bottom 0.254: v80.01,20.32 v77.47,22.86 | v31.75,15.24 31.75,11.18 v29.46,8.89
PIO1_15  (via drill 0.6)
  Top 0.254: S2.4 37.63,19.52 D2.3 37.63,15.28 v36.96,14.61 | U1.43 76.23,16.76 v76.2,16.76 | v73.79,18.03 65.91,10.16 58.42,10.16 57.15,11.43 v42.55,11.43
  Bottom 0.254: v76.2,16.76 74.93,18.03 v73.79,18.03 | v36.96,14.61 39.37,14.61 v42.55,11.43
PIO1_16  (via drill 0.6)
  Top 0.254: S3.4 50.34,19.52 D3.3 | U1.48 72.66,9.53 68.58,9.53 67.94,8.89 57.15,8.89 v56.52,9.53
  Bottom 0.254: v56.52,9.53 55.88,10.16 55.88,15.24 51.44,19.68 S3.4
PIO1_19  (via drill 0.6)
  Top 0.254: S1.4 24.93,19.52 D1.3 23.66,17.14 v23.5,17.14 | U1.2 76.65,10.61 74.93,8.89 69.22,8.89 68.58,8.26 43.18,8.26 v42.55,8.89
  Bottom 0.254: v42.55,8.89 39.37,8.89 38.1,7.62 24.77,7.62 23.5,8.89 v23.5,17.14
PIO1_20  (via drill 0.6)
  Top 0.254: Q1.1 26.36,31.43 26.67,31.11 26.67,24.13 27.3,23.5 55.24,23.5 55.63,23.11 v56.26,23.11 | U1.13 82.45,7.08 v83.57,5.97
  Bottom 0.254: v83.57,5.97 82.3,5.97 68.58,19.68 62.87,19.68 60.33,22.23 57.15,22.23 v56.26,23.11
PIO1_21  (via drill 0.6)
  Top 0.254: Q2.1 39.05,31.43 39.37,31.11 39.37,24.77 40.01,24.13 57.78,24.13 58.04,23.88 v58.17,23.88 | U1.26 85.91,13.52 86.61,14.22 87.12,14.22 87.76,13.59 v87.76,12.57
  Bottom 0.254: v87.76,12.57 85.85,12.57 73.66,24.77 73.66,25.27 72.26,26.67 62.87,26.67 60.33,24.13 58.42,24.13 v58.17,23.88
PIO1_22  (via drill 0.6)
  Top 0.254: Q3.1 46.03,31.43 45.72,31.11 45.72,25.4 46.35,24.77 59.94,24.77 63.12,27.94 v75.56,27.94 | U1.38 78.74,17.78 78.74,22.99 76.33,25.4 v75.56,25.4
  Bottom 0.254: v75.56,25.4 v75.56,27.94
PIO1_23  (via drill 0.6)
  Top 0.254: v85.09,6.99 85.09,7.9 U1.18
  Bottom 0.254: v85.09,6.99 81.92,10.16 80.01,10.16 65.41,24.77 S4.2
PIO1_24  (via drill 0.6)
  Top 0.254: v85.09,3.17 86.36,4.45 86.36,8.75 U1.21 | v64.14,3.17 v64.14,6.35
  Bottom 0.254: v85.09,3.17 83.19,1.27 66.04,1.27 v64.14,3.17 | v64.14,6.35 S5.2
VIN
  Top 0.254: 8.26,9.53 7.94,9.21 7.39,8.66 L1.P$1 6.36,8.26 2.54,8.26 1.27,6.99 1.27,4.45 4.45,1.27 11.43,1.27 13.02,2.86 R1.2 | 8.26,9.53 8.89,10.16 8.89,11.2 C1.+ 8.89,11.66 8.89,13.34 13.65,18.1 R2.2 | U5.8 9.19,8.6 8.26,9.53
  Top 0.61: 7.94,9.21 5.08,12.06 J1.2 4.45,12.7 0.64,16.51 0.64,20.32 2.54,22.23 6.36,22.23 L2.P$1
  pour Top (no thermals): 6.99,9.53 6.99,10.1 7.05,10.1 7.05,10.16 8.22,11.33 8.83,11.33 9.33,10.83 9.33,8.57 9.24,8.48 7.27,8.48 7.27,9.24
  pour Top (no thermals): 9.27,22.35 9.27,25.02 9.27,25.65 8.64,25.65 6.73,23.75 6.73,23.37 7.62,22.48 7.75,22.35

### Text on the board
tPlace: #2013-003 / JWJ | Ext. 3.3 V | + - | + | WHITE | GREEN